# Altium schematic sheet PMIC.SchDoc: PMIC - BLOCK DIAGRAM
size A3; DrawnBy: UKAYACIK; Engineer: UKAYACIK; DocumentNumber: 9; Revision: A; SheetNumber: 9; SheetTotal: 21
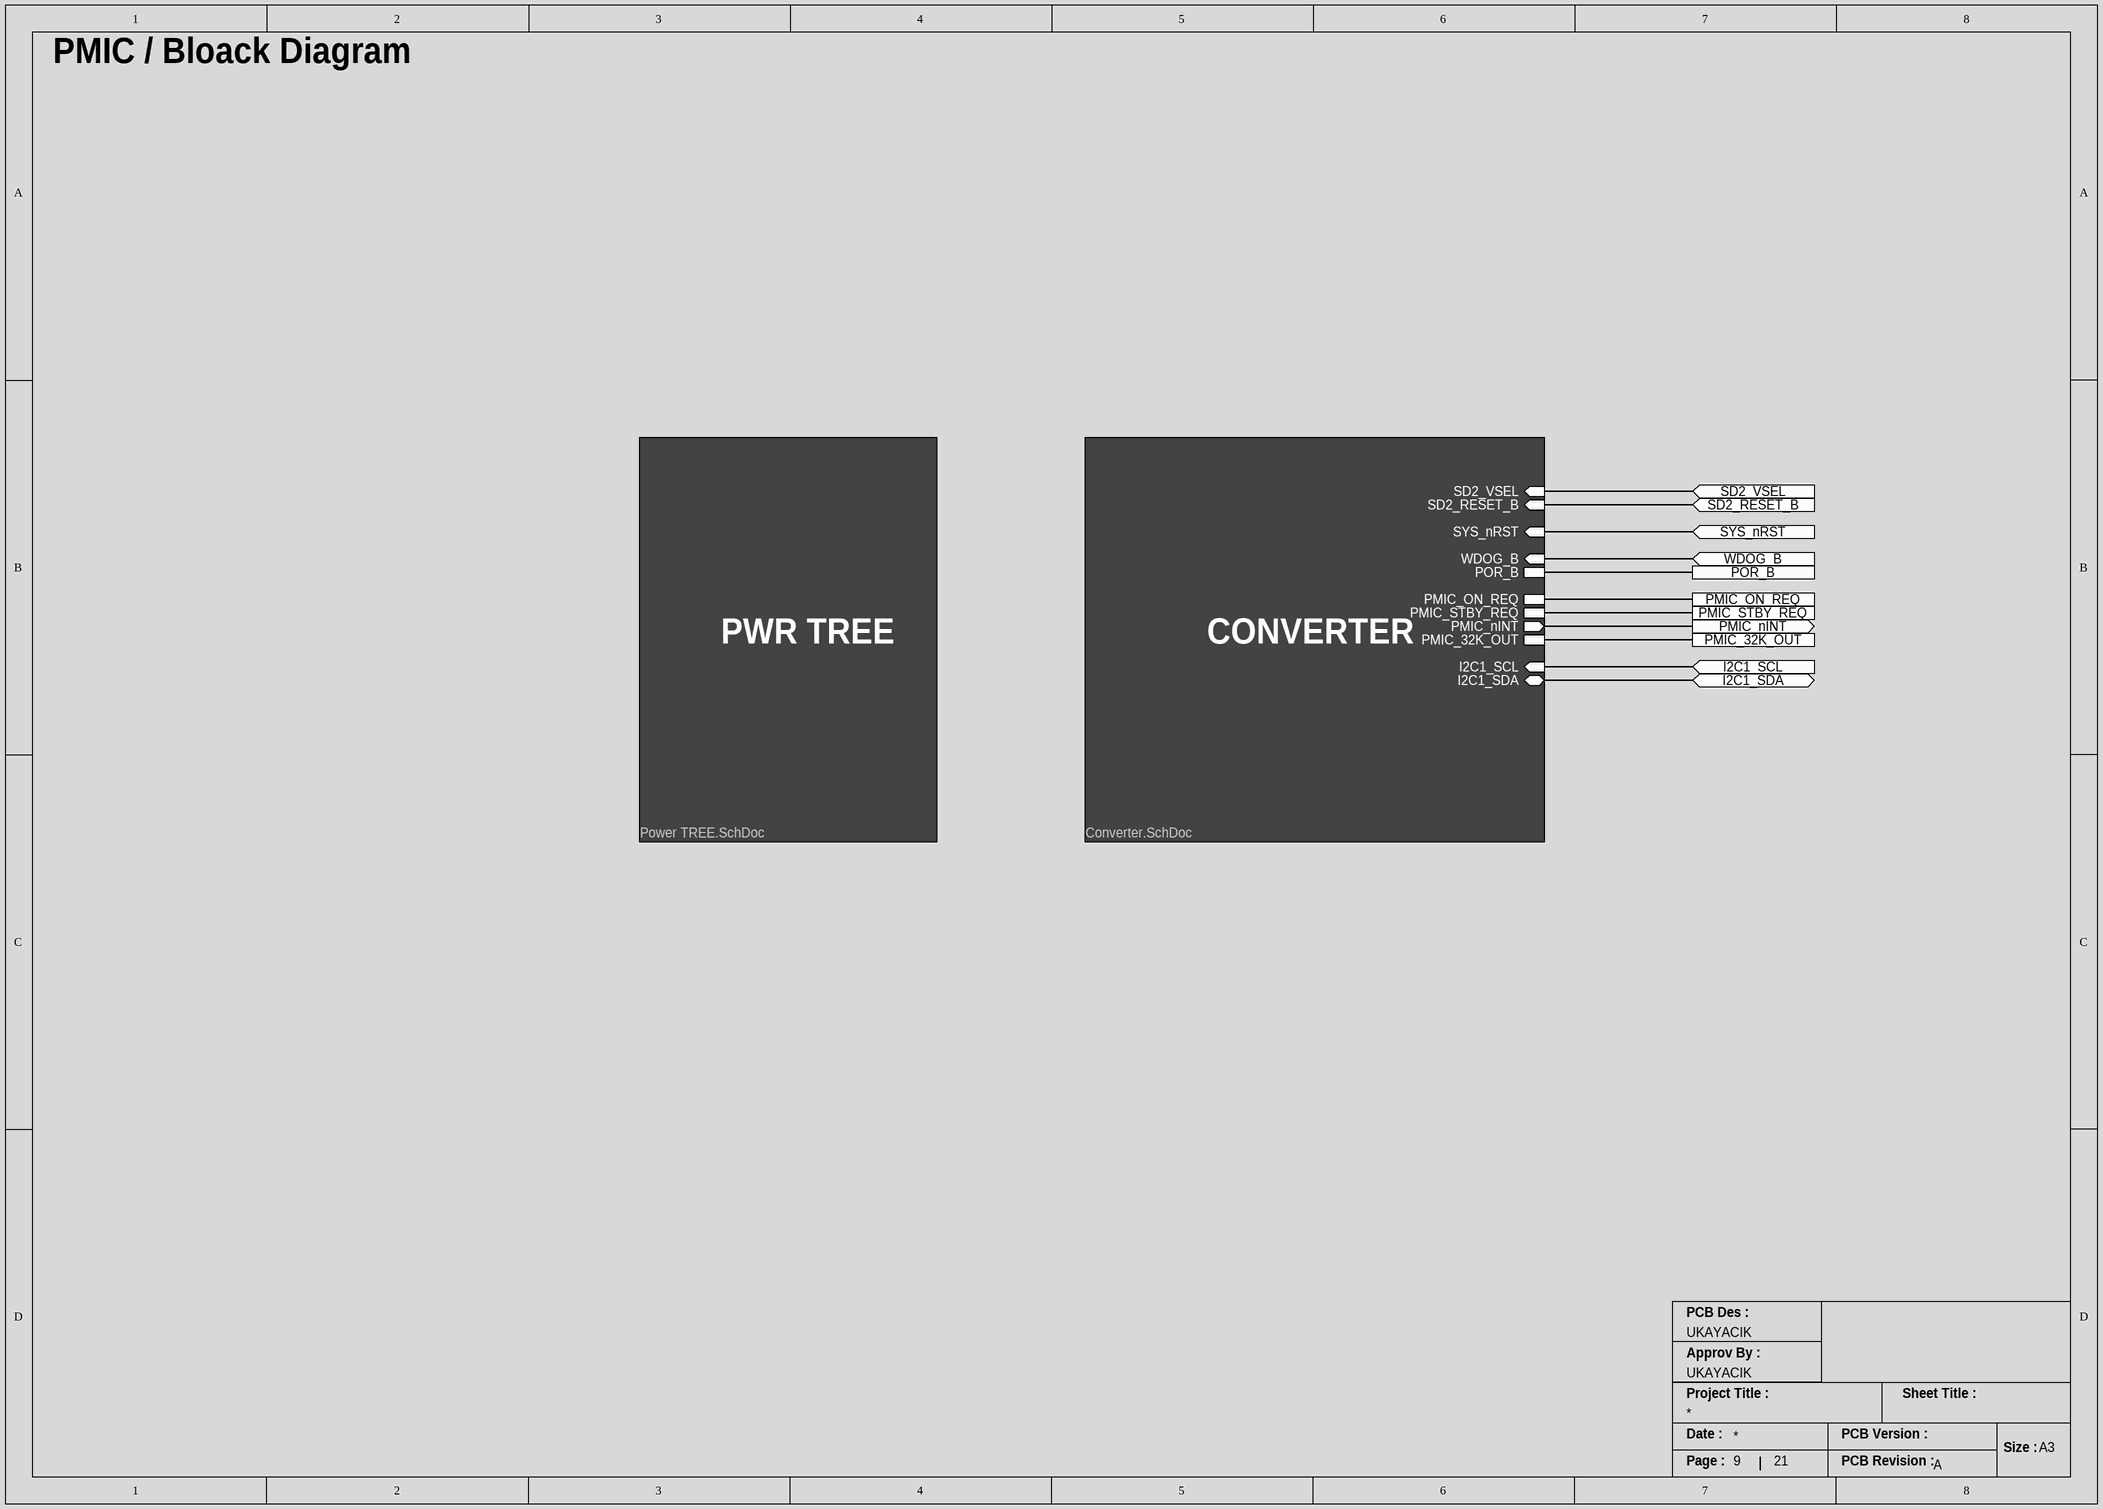
[diagram p0: PMIC.SchDoc]

## Sub-sheets
O = Power TREE.SchDoc: no entries
P = Converter.SchDoc: SD2_VSEL (in), PMIC_ON_REQ, PMIC_STBY_REQ, WDOG_B (in), SYS_nRST (in), POR_B, PMIC_nINT (out), PMIC_32K_OUT, SD2_RESET_B (in), I2C1_SCL (in), I2C1_SDA (bidir)

## Ports
I2C1_SCL (in), I2C1_SDA (bidir), PMIC_32K_OUT, PMIC_nINT (out), PMIC_ON_REQ, PMIC_STBY_REQ, POR_B, SD2_RESET_B (in), SD2_VSEL (in), SYS_nRST (in), WDOG_B (in)

## Nets
I2C1_SCL: port I2C1_SCL, sheet P/I2C1_SCL
I2C1_SDA: port I2C1_SDA, sheet P/I2C1_SDA
PMIC_32K_OUT: port PMIC_32K_OUT, sheet P/PMIC_32K_OUT
PMIC_nINT: port PMIC_nINT, sheet P/PMIC_nINT
PMIC_ON_REQ: port PMIC_ON_REQ, sheet P/PMIC_ON_REQ
PMIC_STBY_REQ: port PMIC_STBY_REQ, sheet P/PMIC_STBY_REQ
POR_B: port POR_B, sheet P/POR_B
SD2_RESET_B: port SD2_RESET_B, sheet P/SD2_RESET_B
SD2_VSEL: port SD2_VSEL, sheet P/SD2_VSEL
SYS_nRST: port SYS_nRST, sheet P/SYS_nRST
WDOG_B: port WDOG_B, sheet P/WDOG_B

## Notes on the sheet
- PMIC / Bloack Diagram
- PWR TREE
- CONVERTER
- PCB Des :
- Approv By :
- Project Title :
- Sheet Title :
- Date :
- PCB Version :
- Size :
- A3
- Page :
- PCB Revision :